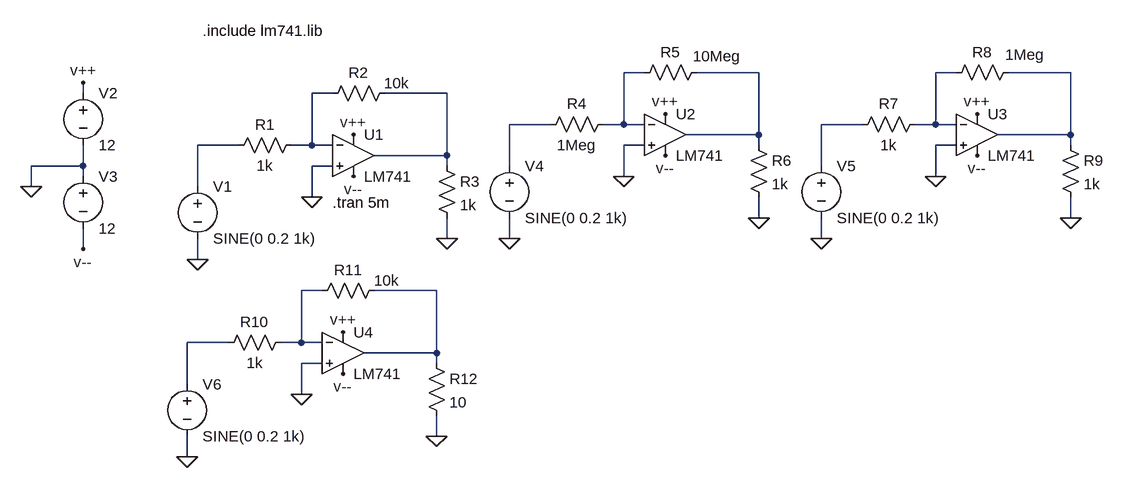
[diagram p0: schematic Simu punto A1.asc]
Simu punto A1.asc, the LTspice schematic file:
Version 4
SHEET 1 1192 680
WIRE 480 0 448 0
WIRE 656 0 560 0
WIRE 960 0 928 0
WIRE 1136 0 1040 0
WIRE -384 32 -384 16
WIRE 0 32 -32 32
WIRE 176 32 80 32
WIRE 336 80 272 80
WIRE 448 80 448 0
WIRE 448 80 416 80
WIRE 480 80 448 80
WIRE 816 80 752 80
WIRE 928 80 928 0
WIRE 928 80 896 80
WIRE 960 80 928 80
WIRE 656 96 656 0
WIRE 656 96 544 96
WIRE 1136 96 1136 0
WIRE 1136 96 1024 96
WIRE -144 112 -208 112
WIRE -32 112 -32 32
WIRE -32 112 -64 112
WIRE 0 112 -32 112
WIRE 480 112 448 112
WIRE 656 112 656 96
WIRE 960 112 928 112
WIRE 1136 112 1136 96
WIRE 176 128 176 32
WIRE 176 128 64 128
WIRE -384 144 -384 112
WIRE -384 144 -464 144
WIRE 0 144 -32 144
WIRE 176 144 176 128
WIRE 272 144 272 80
WIRE 752 144 752 80
WIRE -384 160 -384 144
WIRE 448 160 448 112
WIRE 928 160 928 112
WIRE -464 176 -464 144
WIRE -208 176 -208 112
WIRE -32 192 -32 144
WIRE 656 224 656 192
WIRE 1136 224 1136 192
WIRE 176 256 176 224
WIRE 272 256 272 224
WIRE 752 256 752 224
WIRE -384 272 -384 240
WIRE -208 288 -208 256
WIRE -16 336 -48 336
WIRE 160 336 64 336
WIRE -160 416 -224 416
WIRE -48 416 -48 336
WIRE -48 416 -80 416
WIRE -16 416 -48 416
WIRE 160 432 160 336
WIRE 160 432 48 432
WIRE -16 448 -48 448
WIRE 160 448 160 432
WIRE -224 480 -224 416
WIRE -48 496 -48 448
WIRE 160 560 160 528
WIRE -224 592 -224 560
FLAG -464 176 0
FLAG -208 288 0
FLAG -32 192 0
FLAG 176 256 0
FLAG -384 272 v--
FLAG -384 16 v++
FLAG 32 96 v++
FLAG 32 160 v--
FLAG 272 256 0
FLAG 448 160 0
FLAG 656 224 0
FLAG 512 64 v++
FLAG 752 256 0
FLAG 928 160 0
FLAG 1136 224 0
FLAG 992 64 v++
FLAG 992 128 v--
FLAG -224 592 0
FLAG -48 496 0
FLAG 160 560 0
FLAG 16 400 v++
FLAG 16 464 v--
FLAG 512 128 v--
SYMBOL OpAmps\\opamp2 32 64 R0
SYMATTR InstName U1
SYMATTR Value LM741
SYMBOL res -48 96 R90
WINDOW 0 0 56 VBottom 2
WINDOW 3 32 56 VTop 2
SYMATTR InstName R1
SYMATTR Value 1k
SYMBOL res 96 16 R90
WINDOW 0 0 56 VBottom 2
WINDOW 3 -15 -3 VTop 2
SYMATTR InstName R2
SYMATTR Value 10k
SYMBOL voltage -208 160 R0
WINDOW 123 0 0 Left 0
WINDOW 39 0 0 Left 0
SYMATTR InstName V1
SYMATTR Value SINE(0 0.2 1k)
SYMBOL voltage -384 16 R0
WINDOW 123 0 0 Left 0
WINDOW 39 0 0 Left 0
SYMATTR InstName V2
SYMATTR Value 12
SYMBOL voltage -384 144 R0
WINDOW 123 0 0 Left 0
WINDOW 39 0 0 Left 0
SYMATTR InstName V3
SYMATTR Value 12
SYMBOL res 160 128 R0
SYMATTR InstName R3
SYMATTR Value 1k
SYMBOL OpAmps\\opamp2 512 32 R0
SYMATTR InstName U2
SYMATTR Value LM741
SYMBOL res 432 64 R90
WINDOW 0 0 56 VBottom 2
WINDOW 3 32 56 VTop 2
SYMATTR InstName R4
SYMATTR Value 1Meg
SYMBOL res 576 -16 R90
WINDOW 0 0 56 VBottom 2
WINDOW 3 -25 -16 VTop 2
SYMATTR InstName R5
SYMATTR Value 10Meg
SYMBOL res 640 96 R0
SYMATTR InstName R6
SYMATTR Value 1k
SYMBOL OpAmps\\opamp2 992 32 R0
SYMATTR InstName U3
SYMATTR Value LM741
SYMBOL res 912 64 R90
WINDOW 0 0 56 VBottom 2
WINDOW 3 32 56 VTop 2
SYMATTR InstName R7
SYMATTR Value 1k
SYMBOL res 1056 -16 R90
WINDOW 0 0 56 VBottom 2
WINDOW 3 -27 -10 VTop 2
SYMATTR InstName R8
SYMATTR Value 1Meg
SYMBOL res 1120 96 R0
SYMATTR InstName R9
SYMATTR Value 1k
SYMBOL voltage 272 128 R0
WINDOW 123 0 0 Left 0
WINDOW 39 0 0 Left 0
SYMATTR InstName V4
SYMATTR Value SINE(0 0.2 1k)
SYMBOL voltage 752 128 R0
WINDOW 123 0 0 Left 0
WINDOW 39 0 0 Left 0
SYMATTR InstName V5
SYMATTR Value SINE(0 0.2 1k)
SYMBOL OpAmps\\opamp2 16 368 R0
SYMATTR InstName U4
SYMATTR Value LM741
SYMBOL res -64 400 R90
WINDOW 0 0 56 VBottom 2
WINDOW 3 32 56 VTop 2
SYMATTR InstName R10
SYMATTR Value 1k
SYMBOL res 80 320 R90
WINDOW 0 0 56 VBottom 2
WINDOW 3 -15 -3 VTop 2
SYMATTR InstName R11
SYMATTR Value 10k
SYMBOL voltage -224 464 R0
WINDOW 123 0 0 Left 0
WINDOW 39 0 0 Left 0
SYMATTR InstName V6
SYMATTR Value SINE(0 0.2 1k)
SYMBOL res 144 432 R0
SYMATTR InstName R12
SYMATTR Value 10
TEXT -200 -64 Left 2 !.include lm741.lib
TEXT 0 200 Left 2 !.tran 5m

The netlist it stands for:
* Simu punto A1.asc
XU1 0 N005 v++ v-- N006 LM741  ; pins In+ In- V+ V- OUT
R1 N005 N009 1k
R2 N006 N005 10k
V1 N009 0 SINE(0 0.2 1k)
V2 v++ 0 12
V3 0 v-- 12
R3 N006 0 1k
XU2 0 N001 v++ v-- N002 LM741  ; pins In+ In- V+ V- OUT
R4 N001 N007 1Meg
R5 N002 N001 10Meg
R6 N002 0 1k
XU3 0 N003 v++ v-- N004 LM741  ; pins In+ In- V+ V- OUT
R7 N003 N008 1k
R8 N004 N003 1Meg
R9 N004 0 1k
V4 N007 0 SINE(0 0.2 1k)
V5 N008 0 SINE(0 0.2 1k)
XU4 0 N010 v++ v-- N011 LM741  ; pins In+ In- V+ V- OUT
R10 N010 N012 1k
R11 N011 N010 10k
V6 N012 0 SINE(0 0.2 1k)
R12 N011 0 10
.include lm741.lib
.tran 5m
.backanno
.end